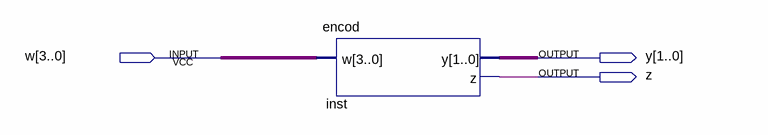
[diagram p0: schematic sheet]
// Quartus schematic encod.bdf as structural Verilog: 1 symbols, 3 pins
module encod (
  input  [3:0] w,
  output [1:0] y,
  output z
);

  encod inst (.w(w), .y(y), .z(z));
endmodule
